# Altium schematic sheet S09.SchDoc: IEEE-1394/Ethernet FPGA Controller
size 381 x 254 mm; Revision: 3.2; SheetNumber: 9; SheetTotal: 10
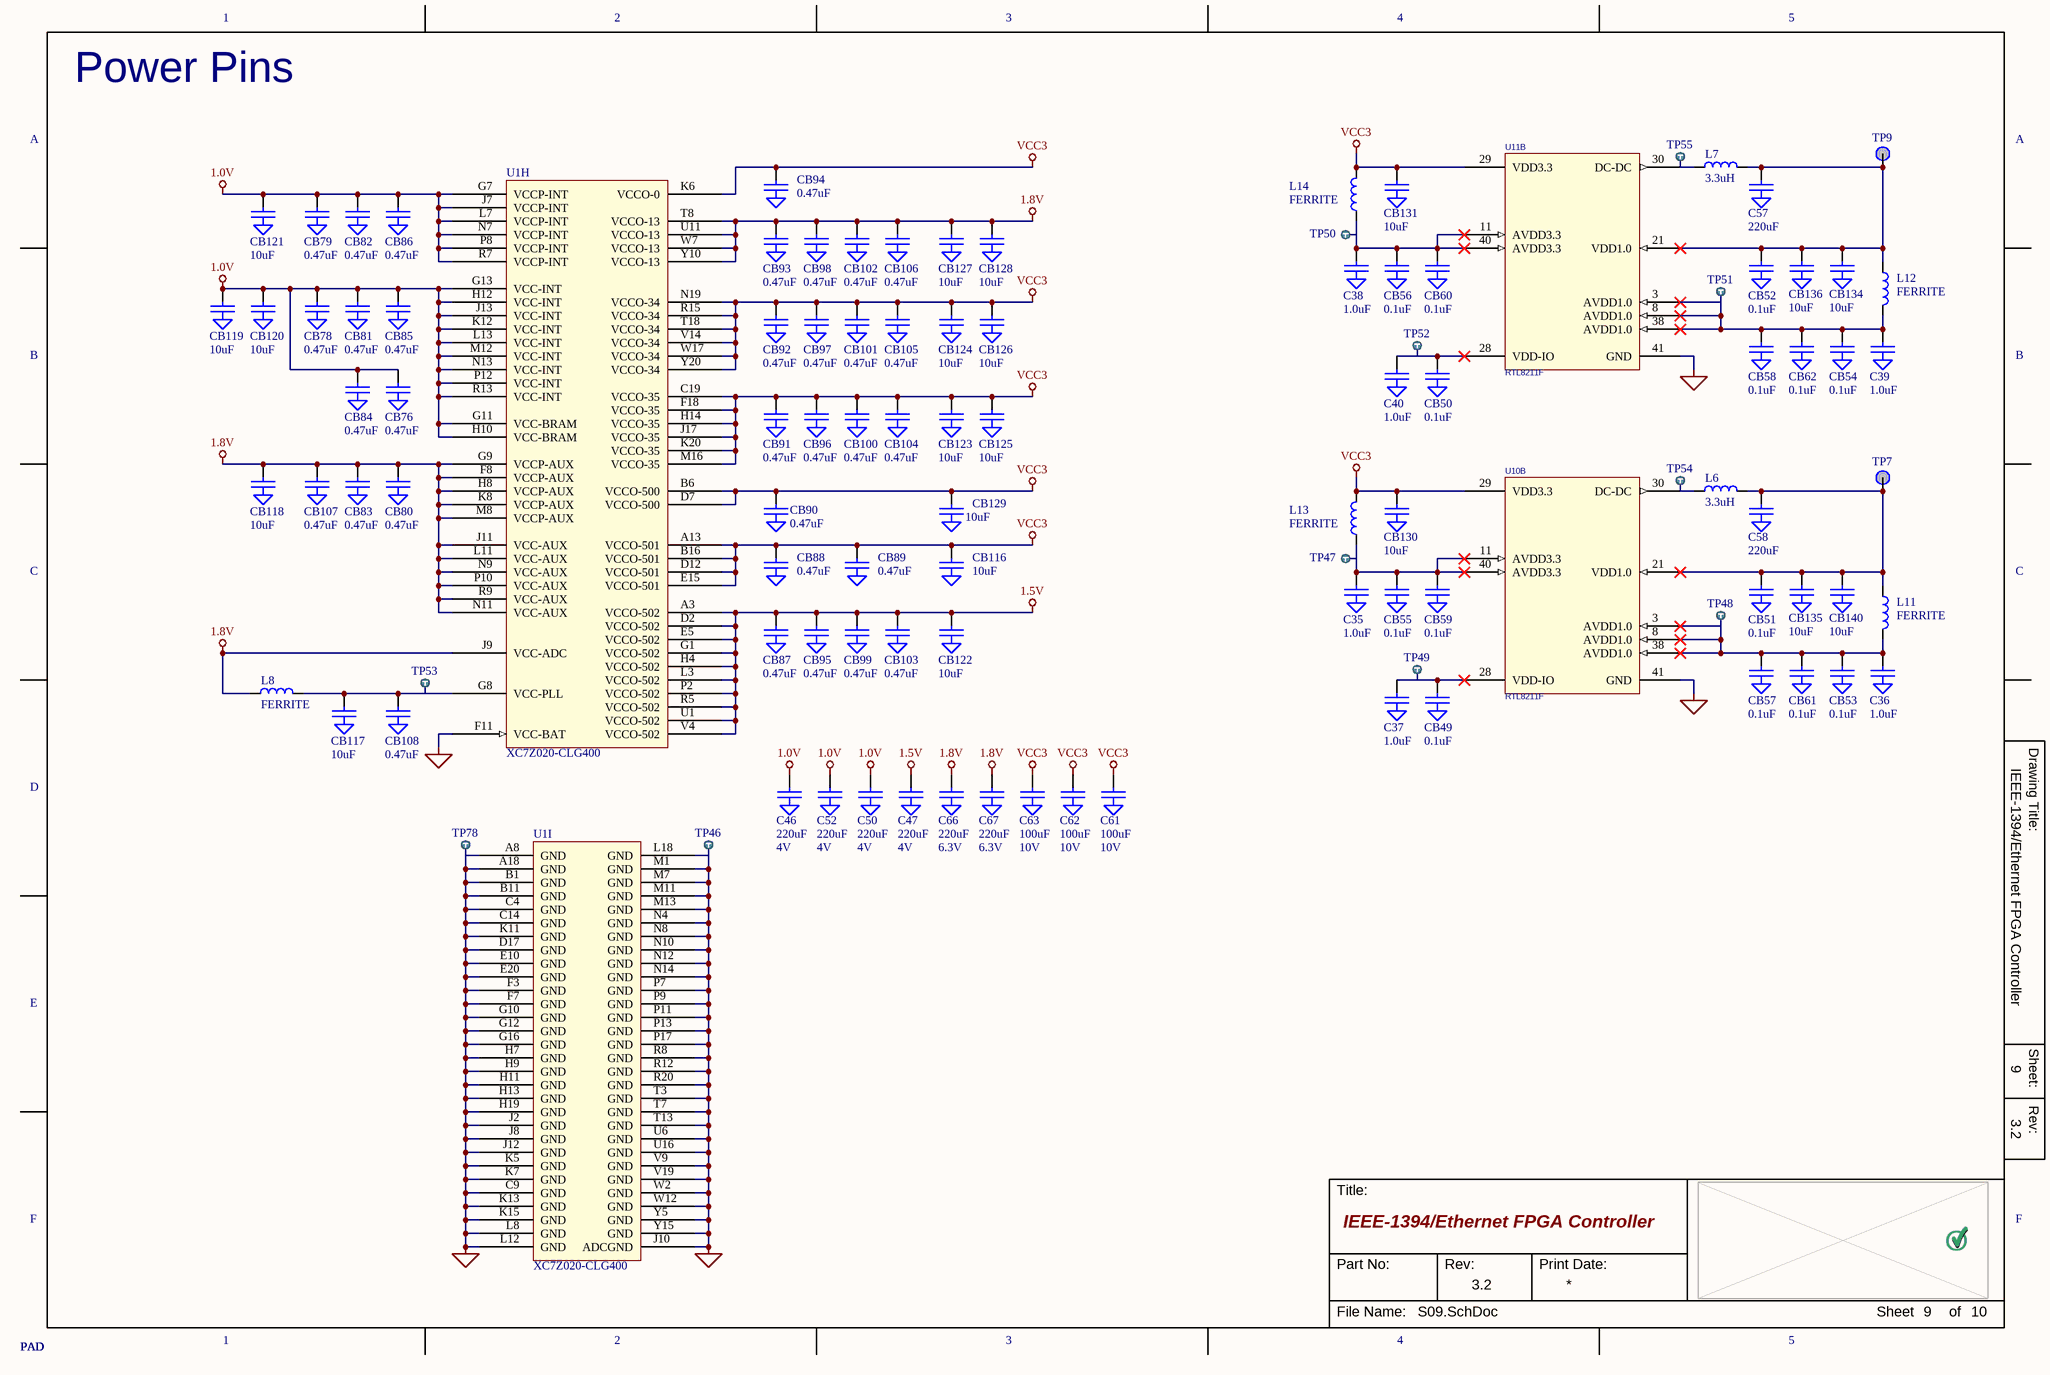
[diagram p0: S09.SchDoc]

## Parts
C35  1.0uF  [C0402]
C36  1.0uF  [C0402]
C37  1.0uF  [C0402]
C38  1.0uF  [C0402]
C39  1.0uF  [C0402]
C40  1.0uF  [C0402]
C46  220uF  Parameter 1: 4V  [C1206]
C47  220uF  Parameter 1: 4V  [C1206]
C50  220uF  Parameter 1: 4V  [C1206]
C52  220uF  Parameter 1: 4V  [C1206]
C57  220uF  [C1206]
C58  220uF  [C1206]
C61  100uF  Parameter 1: 10V  [C1210]
C62  100uF  Parameter 1: 10V  [C1210]
C63  100uF  Parameter 1: 10V  [C1210]
C66  220uF  Parameter 1: 6.3V  [C1210]
C67  220uF  Parameter 1: 6.3V  [C1210]
CB49  0.1uF  [C0201]
CB50  0.1uF  [C0201]
CB51  0.1uF  [C0201]
CB52  0.1uF  [C0201]
CB53  0.1uF  [C0201]
CB54  0.1uF  [C0201]
CB55  0.1uF  [C0201]
CB56  0.1uF  [C0201]
CB57  0.1uF  [C0201]
CB58  0.1uF  [C0201]
CB59  0.1uF  [C0201]
CB60  0.1uF  [C0201]
CB61  0.1uF  [C0201]
CB62  0.1uF  [C0201]
CB76  0.47uF  [CB0402]
CB78  0.47uF  [CB0402]
CB79  0.47uF  [CB0402]
CB80  0.47uF  [CB0402]
CB81  0.47uF  [CB0402]
CB82  0.47uF  [CB0402]
CB83  0.47uF  [CB0402]
CB84  0.47uF  [CB0402]
CB85  0.47uF  [CB0402]
CB86  0.47uF  [CB0402]
CB87  0.47uF  [CB0402]
CB88  0.47uF  [CB0402]
CB89  0.47uF  [CB0402]
CB90  0.47uF  [CB0402]
CB91  0.47uF  [CB0402]
CB92  0.47uF  [CB0402]
CB93  0.47uF  [CB0402]
CB94  0.47uF  [CB0402]
CB95  0.47uF  [CB0402]
CB96  0.47uF  [CB0402]
CB97  0.47uF  [CB0402]
CB98  0.47uF  [CB0402]
CB99  0.47uF  [CB0402]
CB100  0.47uF  [CB0402]
CB101  0.47uF  [CB0402]
CB102  0.47uF  [CB0402]
CB103  0.47uF  [CB0402]
CB104  0.47uF  [CB0402]
CB105  0.47uF  [CB0402]
CB106  0.47uF  [CB0402]
CB107  0.47uF  [CB0402]
CB108  0.47uF  [CB0402]
CB116  10uF  [CB0603]
CB117  10uF  [CB0603]
CB118  10uF  [CB0603]
CB119  10uF  [CB0603]
CB120  10uF  [CB0603]
CB121  10uF  [CB0603]
CB122  10uF  [CB0603]
CB123  10uF  [CB0603]
CB124  10uF  [CB0603]
CB125  10uF  [CB0603]
CB126  10uF  [CB0603]
CB127  10uF  [CB0603]
CB128  10uF  [CB0603]
CB129  10uF  [CB0603]
CB130  10uF  [CB0603]
CB131  10uF  [CB0603]
CB134  10uF  [CB0603]
CB135  10uF  [CB0603]
CB136  10uF  [CB0603]
CB140  10uF  [CB0603]
L6  3.3uH  [INDUCTOR-EPL2014]
L7  3.3uH  [INDUCTOR-EPL2014]
L8  FERRITE  [L0603]
L11  FERRITE  [l0402]
L12  FERRITE  [l0402]
L13  FERRITE  [l0402]
L14  FERRITE  [l0402]
TP7  PAD  [PAD25-SM]  (value not drawn)  (no BOM)
TP9  PAD  [PAD25-SM]  (value not drawn)  (no BOM)
TP46  Footprint: PAD  (hidden comment: GND)  (no BOM)
TP47  Footprint: PAD  (hidden comment: NOLBL_C35_1_1)  (no BOM)
TP48  Footprint: PAD  (hidden comment: NOLBL_C36_1_1)  (no BOM)
TP49  Footprint: PAD  (hidden comment: NOLBL_C37_1_1)  (no BOM)
TP50  Footprint: PAD  (hidden comment: NOLBL_C38_1_1)  (no BOM)
TP51  Footprint: PAD  (hidden comment: NOLBL_C39_1_1)  (no BOM)
TP52  Footprint: PAD  (hidden comment: NOLBL_C40_1_1)  (no BOM)
TP53  Footprint: PAD  (hidden comment: NOLBL_CB108_1_1)  (no BOM)
TP54  Footprint: PAD  (hidden comment: NOLBL_L6_1_1)  (no BOM)
TP55  Footprint: PAD  (hidden comment: NOLBL_L7_1_1)  (no BOM)
TP78  Footprint: PAD  (hidden comment: GND)  (no BOM)
U1  XC7Z020-CLG400  [BGA-400-08mm]  (parts H,I of 9)
U10  RTL8211F  [QFN-40-5MM]  (part B of 2)
U11  RTL8211F  [QFN-40-5MM]  (part B of 2)

## Nets
1.0V: C46.1 C50.1 C52.1 CB76.1 CB78.1 CB79.1 CB81.1 CB82.1 CB84.1 CB85.1 CB86.1 CB119.1 CB120.1 CB121.1 U1.G7(VCCP-INT) U1.G11(VCC-BRAM) U1.G13(VCC-INT) U1.H10(VCC-BRAM) U1.H12(VCC-INT) U1.J7(VCCP-INT) U1.J13(VCC-INT) U1.K12(VCC-INT) U1.L7(VCCP-INT) U1.L13(VCC-INT) U1.M12(VCC-INT) U1.N7(VCCP-INT) U1.N13(VCC-INT) U1.P8(VCCP-INT) U1.P12(VCC-INT) U1.R7(VCCP-INT) U1.R13(VCC-INT)
1.5V: C47.1 CB87.1 CB95.1 CB99.1 CB103.1 CB122.1 U1.A3(VCCO-502) U1.D2(VCCO-502) U1.E5(VCCO-502) U1.G1(VCCO-502) U1.H4(VCCO-502) U1.L3(VCCO-502) U1.P2(VCCO-502) U1.R5(VCCO-502) U1.U1(VCCO-502) U1.V4(VCCO-502)
1.8V: C66.1 C67.1 CB80.1 CB83.1 CB93.1 CB98.1 CB102.1 CB106.1 CB107.1 CB118.1 CB127.1 CB128.1 L8.1 U1.F8(VCCP-AUX) U1.G9(VCCP-AUX) U1.H8(VCCP-AUX) U1.J9(VCC-ADC) U1.J11(VCC-AUX) U1.K8(VCCP-AUX) U1.L11(VCC-AUX) U1.M8(VCCP-AUX) U1.N9(VCC-AUX) U1.N11(VCC-AUX) U1.P10(VCC-AUX) U1.R9(VCC-AUX) U1.T8(VCCO-13) U1.U11(VCCO-13) U1.W7(VCCO-13) U1.Y10(VCCO-13)
GND: C35.2(GND) C36.2(GND) C37.2(GND) C38.2(GND) C39.2(GND) C40.2(GND) C46.2(GND) C47.2(GND) C50.2(GND) C52.2(GND) C57.2(GND) C58.2(GND) C61.2(GND) C62.2(GND) C63.2(GND) C66.2(GND) C67.2(GND) CB49.2(GND) CB50.2(GND) CB51.2(GND) CB52.2(GND) CB53.2(GND) CB54.2(GND) CB55.2(GND) CB56.2(GND) CB57.2(GND) CB58.2(GND) CB59.2(GND) CB60.2(GND) CB61.2(GND) CB62.2(GND) CB76.2(GND) CB78.2(GND) CB79.2(GND) CB80.2(GND) CB81.2(GND) CB82.2(GND) CB83.2(GND) CB84.2(GND) CB85.2(GND) CB86.2(GND) CB87.2(GND) CB88.2(GND) CB89.2(GND) CB90.2(GND) CB91.2(GND) CB92.2(GND) CB93.2(GND) CB94.2(GND) CB95.2(GND) CB96.2(GND) CB97.2(GND) CB98.2(GND) CB99.2(GND) CB100.2(GND) CB101.2(GND) CB102.2(GND) CB103.2(GND) CB104.2(GND) CB105.2(GND) CB106.2(GND) CB107.2(GND) CB108.2(GND) CB116.2(GND) CB117.2(GND) CB118.2(GND) CB119.2(GND) CB120.2(GND) CB121.2(GND) CB122.2(GND) CB123.2(GND) CB124.2(GND) CB125.2(GND) CB126.2(GND) CB127.2(GND) CB128.2(GND) CB129.2(GND) CB130.2(GND) CB131.2(GND) CB134.2(GND) CB135.2(GND) CB136.2(GND) CB140.2(GND) TP46.1 TP78.1 U1.A8(GND) U1.A18(GND) U1.B1(GND) U1.B11(GND) U1.C4(GND) U1.C9(GND) U1.C14(GND) U1.D17(GND) U1.E10(GND) U1.E20(GND) U1.F3(GND) U1.F7(GND) U1.F11(VCC-BAT) U1.G10(GND) U1.G12(GND) U1.G16(GND) U1.H7(GND) U1.H9(GND) U1.H11(GND) U1.H13(GND) U1.H19(GND) U1.J2(GND) U1.J8(GND) U1.J10(ADCGND) U1.J12(GND) U1.K5(GND) U1.K7(GND) U1.K11(GND) U1.K13(GND) U1.K15(GND) U1.L8(GND) U1.L12(GND) U1.L18(GND) U1.M1(GND) U1.M7(GND) U1.M11(GND) U1.M13(GND) U1.N4(GND) U1.N8(GND) U1.N10(GND) U1.N12(GND) U1.N14(GND) U1.P7(GND) U1.P9(GND) U1.P11(GND) U1.P13(GND) U1.P17(GND) U1.R8(GND) U1.R12(GND) U1.R20(GND) U1.T3(GND) U1.T7(GND) U1.T13(GND) U1.U6(GND) U1.U16(GND) U1.V9(GND) U1.V19(GND) U1.W2(GND) U1.W12(GND) U1.Y5(GND) U1.Y15(GND) U10.41(GND) U11.41(GND)
VCC3: C61.1 C62.1 C63.1 CB88.1 CB89.1 CB90.1 CB91.1 CB92.1 CB94.1 CB96.1 CB97.1 CB100.1 CB101.1 CB104.1 CB105.1 CB116.1 CB123.1 CB124.1 CB125.1 CB126.1 CB129.1 CB130.1 CB131.1 L13.2 L14.2 U1.A13(VCCO-501) U1.B6(VCCO-500) U1.B16(VCCO-501) U1.C19(VCCO-35) U1.D7(VCCO-500) U1.D12(VCCO-501) U1.E15(VCCO-501) U1.F18(VCCO-35) U1.H14(VCCO-35) U1.J17(VCCO-35) U1.K6(VCCO-0) U1.K20(VCCO-35) U1.M16(VCCO-35) U1.N19(VCCO-34) U1.R15(VCCO-34) U1.T18(VCCO-34) U1.V14(VCCO-34) U1.W17(VCCO-34) U1.Y20(VCCO-34) U10.29(VDD3.3) U11.29(VDD3.3)
NetC35_1: C35.1 CB55.1 CB59.1 L13.1 TP47.1 U10.11(AVDD3.3) U10.40(AVDD3.3)
NetC36_1: C36.1 CB53.1 CB57.1 CB61.1 L11.2 TP48.1 U10.3(AVDD1.0) U10.8(AVDD1.0) U10.38(AVDD1.0)
NetC37_1: C37.1 CB49.1 TP49.1 U10.28(VDD-IO)
NetC38_1: C38.1 CB56.1 CB60.1 L14.1 TP50.1 U11.11(AVDD3.3) U11.40(AVDD3.3)
NetC39_1: C39.1 CB54.1 CB58.1 CB62.1 L12.2 TP51.1 U11.3(AVDD1.0) U11.8(AVDD1.0) U11.38(AVDD1.0)
NetC40_1: C40.1 CB50.1 TP52.1 U11.28(VDD-IO)
NetC57_1: C57.1 CB52.1 CB134.1 CB136.1 L7.2 L12.1 TP9.1 U11.21(VDD1.0)
NetC58_1: C58.1 CB51.1 CB135.1 CB140.1 L6.2 L11.1 TP7.1 U10.21(VDD1.0)
NetCB108_1: CB108.1 CB117.1 L8.2 TP53.1 U1.G8(VCC-PLL)
NetL6_1: L6.1 TP54.1 U10.30(DC-DC)
NetL7_1: L7.1 TP55.1 U11.30(DC-DC)

## Notes on the sheet
- Power Pins
- 1
- 2
- 3
- 4
- 5
- A
- B
- C
- Drawing Title:
- D
- E
- Sheet:
- Rev:
- F
- Title:
- Part No:
- Print Date:
- File Name:
- Sheet
- of

## Library data of the parts
C35-C40 C46 C47 C50 C52 C57 C58 C61-C63 C66 C67 CB49-CB62 CB76 CB78-CB108 CB116-CB131 CB134-CB136 CB140 = CAP-GND
L6-L8 L11-L14 = INDUCTOR
TP46 TP48 TP49 TP51-TP55 TP78 = Tomachie_TP_North: Test Point
TP47 TP50 = Tomachie_TP_West: Test Point
U10 U11 = RTL8211F: Ethernet PHY